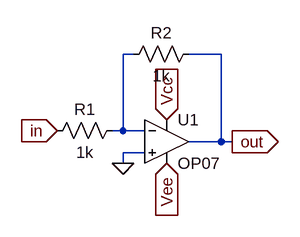
[diagram p0: schematic invertor.asc]
invertor.asc, the LTspice schematic file:
Version 4.1
SHEET 1 880 680
WIRE 272 80 256 80
WIRE 400 80 352 80
WIRE 256 192 256 80
WIRE 256 192 240 192
WIRE 288 192 256 192
WIRE 400 208 400 80
WIRE 400 208 352 208
WIRE 416 208 400 208
WIRE 288 224 256 224
WIRE 256 240 256 224
FLAG 256 240 0
FLAG 320 176 Vcc
IOPIN 320 176 In
FLAG 320 240 Vee
IOPIN 320 240 In
FLAG 160 192 in
IOPIN 160 192 In
FLAG 416 208 out
IOPIN 416 208 Out
SYMBOL OpAmps\\OP07 320 144 R0
SYMATTR InstName U1
SYMBOL res 256 176 R90
WINDOW 0 0 56 VBottom 2
WINDOW 3 32 56 VTop 2
SYMATTR InstName R1
SYMATTR Value 1k
SYMBOL res 368 64 R90
WINDOW 0 0 56 VBottom 2
WINDOW 3 32 56 VTop 2
SYMATTR InstName R2
SYMATTR Value 1k

The netlist it stands for:
* invertor.asc
X§U1 0 N001 Vcc Vee out LT1001  ; OP07, pins In+ In- V+ V- OUT
R1 N001 in 1k
R2 out N001 1k
.lib LTC.lib
.backanno
.end